# Altium schematic sheet MSP-ISO_Rev1_0.SchDoc
size 431 x 279 mm; Date: Not shown in title block; ApprovedBy: Not shown in title block; CheckedBy: Not shown in title block; Author: Not shown in title block; CompanyName: Not shown in title block; Engineer: Not shown in title block; Organization: Not shown in title block; Address1: Not shown in title block; Address2: Not shown in title block; Address3: Not shown in title block; Address4: Not shown in title block; DocumentNumber: 1; Revision: Use project parameter SCH_Rev; SheetNumber: 3; SheetTotal: 3; PageSetup: Record=PageOptions|CenterHorizontal=True|CenterVertical=True|PrintScale=0.66|XCorrection=1.00|YCorrection=1.00|PrintKind=0|BorderSize=5000000|LeftOffset=0|BottomOffset=0|Orientation=2|PaperLength=1000|PaperWidth=1000|Scale=100|PaperSource=15|PrintQuality=600|MediaType=1|DitherType=10|PrintScaleMode=1|PaperKind=Letter; CurrentTime: Not shown in title block; CurrentDate: Not shown in title block; Time: Not shown in title block; DocumentFullPathAndName: Not shown in title block; DocumentName: Not shown in title block; ModifiedDate: Not shown in title block; ImagePath: Not shown in title block
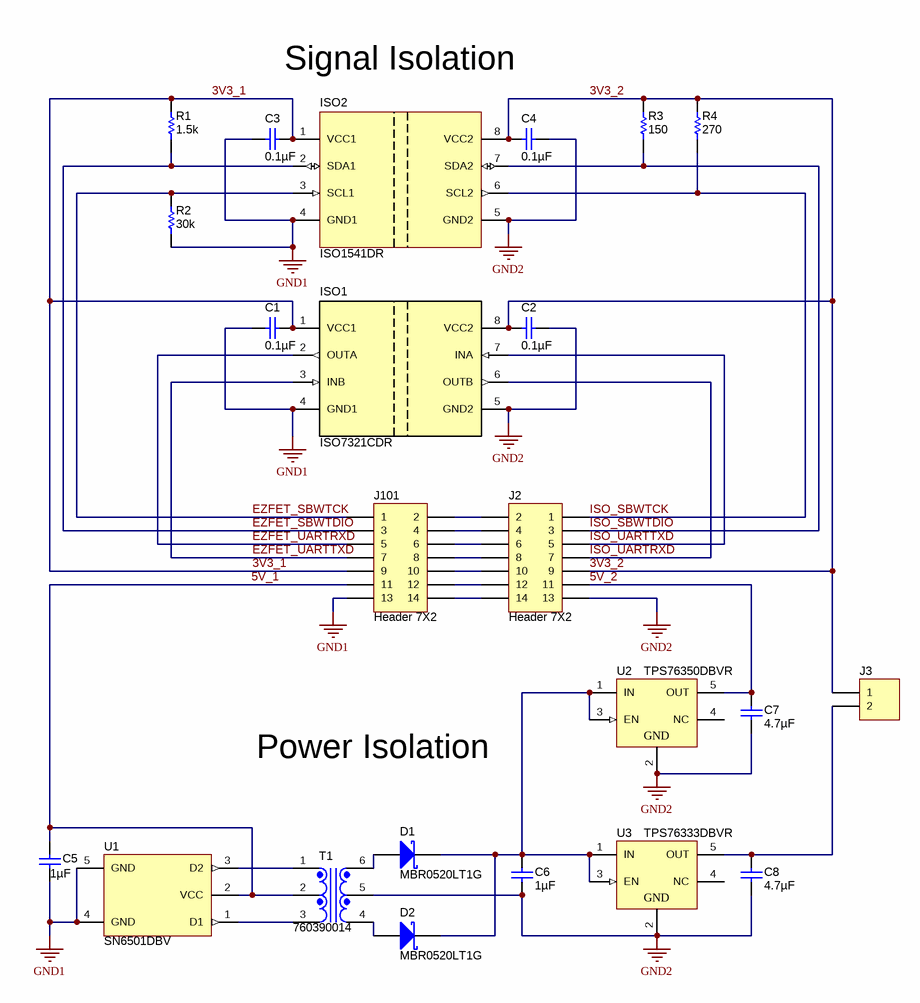
[diagram p0: MSP-ISO_Rev1_0.SchDoc]

## Parts
C1  ValueDisplayed: 0.1µF  [0603]  (hidden comment: 0603YC104JAT2A)
C2  ValueDisplayed: 0.1µF  [0603]  (hidden comment: 0603YC104JAT2A)
C3  ValueDisplayed: 0.1µF  [0603]  (hidden comment: 0603YC104JAT2A)
C4  ValueDisplayed: 0.1µF  [0603]  (hidden comment: 0603YC104JAT2A)
C5  ValueDisplayed: 1µF  [0603]  (hidden comment: C1608X7R1C105K)
C6  ValueDisplayed: 1µF  [0603]  (hidden comment: C1608X7R1C105K)
C7  ValueDisplayed: 4.7µF  [0603]  (hidden comment: C1608X5R0J475M)
C8  ValueDisplayed: 4.7µF  [0603]  (hidden comment: C1608X5R0J475M)
D1  MBR0520LT1G  [SOD-123]
D2  MBR0520LT1G  [SOD-123]
ISO1  ISO7321CDR  [D0008B_N]
ISO2  ISO1541DR  [D0008A_N]
J2  Header 7X2  [HDR2X7]
J3  Supply_components  [HDR1X2]  (value not drawn)
J101  Header 7X2  [HDR2X7]
R1  ValueDisplayed: 1.5k  [0402]  (hidden comment: CRCW04021K50JNED)
R2  ValueDisplayed: 30k  [0402]  (hidden comment: CRCW040230K0JNED)
R3  ValueDisplayed: 150  [0402]  (hidden comment: CRCW0402150RJNED)
R4  ValueDisplayed: 270  [0402]  (hidden comment: CRCW0402270RJNED)
T1  760390014  [Wurth_760390013]
U1  SN6501DBV  [DBV0005A_N]
U2  TPS76350DBVR  [DBV0005A_N]
U3  TPS76333DBVR  [DBV0005A_N]

## Nets
GND1: C1.2 C3.2 C5.2 ISO1.4(GND1) ISO2.4(GND1) J101.13 R2.1 U1.4(GND) U1.5(GND)
GND2: C2.2 C4.2 C6.2 C7.2 C8.2 ISO1.5(GND2) ISO2.5(GND2) J2.13 T1.5 U2.2(GND) U3.2(GND)
3V3_1: C1.1 C3.1 ISO1.1(VCC1) ISO2.1(VCC1) J101.9 R1.2
3V3_2: C2.1 C4.1 ISO1.8(VCC2) ISO2.8(VCC2) J2.9 J3.1 R3.2 R4.2
5V_1: C5.1 J101.11 T1.2 U1.2(VCC)
5V_2: C7.1 J2.11 U2.5(OUT)
EZFET_SBWTCK: ISO2.3(SCL1) J101.1 R2.2
EZFET_SBWTDIO: ISO2.2(SDA1) J101.3 R1.1
EZFET_UARTRXD: ISO1.2(OUTA) J101.5
EZFET_UARTTXD: ISO1.3(INB) J101.7
ISO_SBWTCK: ISO2.6(SCL2) J2.1 R4.1
ISO_SBWTDIO: ISO2.7(SDA2) J2.3 R3.1
ISO_UARTRXD: ISO1.6(OUTB) J2.7
ISO_UARTTXD: ISO1.7(INA) J2.5
NetC6_1: C6.1 D1.1(K) D2.1(K) U2.1(IN) U2.3(EN) U3.1(IN) U3.3(EN)
NetC8_1: C8.1 J3.2 U3.5(OUT)
NetD1_2: D1.2(A) T1.6
NetD2_2: D2.2(A) T1.4
NetJ2_2: J2.2 J101.2
NetJ2_4: J2.4 J101.4
NetJ2_6: J2.6 J101.6
NetJ2_8: J2.8 J101.8
NetJ2_10: J2.10 J101.10
NetJ2_12: J2.12 J101.12
NetJ2_14: J2.14 J101.14
NetT1_1: T1.1 U1.3(D2)
NetT1_3: T1.3 U1.1(D1)

Not connected (* = marked no-connect by the designer): U2 4(NC); U3 4(NC)

## Notes on the sheet
- Signal Isolation
- Power Isolation
- Drawn By:
- SVN Rev:
- Number:
- TID #:
- Orderable:
- Rev:
- Sheet Title:
- File:
- Project Title:
- Designed for:
- Assembly Variant:
- Mod. Date:
- Sheet:
- Size:
- of
- B
- http://www.ti.com
- Texas Instruments and/or its licensors do not warrant the accuracy or completeness of this specification or any information contained therein. Texas Instruments and/or its licensors do not warrant that this design will meet the specifications, will be suitable for your application or fit for any particular purpose, or will operate in an implementation. Texas Instruments and/or its licensors do not warrant that the design is production worthy. You should completely validate and test your design implementation to confirm the system functionality for your application.
- Engineer:
- Contact:
- © Texas Instruments

## Library data of the parts
C1-C4 = 0603YC104JAT2A: CAP, CERM, 0.1 µF, 16 V, +/- 5%, X7R, 0603; Manufacturer: AVX; Polarized: N; CompType: Capacitor; Value: 0.1uF; U/M: EA; Cap_F: 0.0000001; Tolerance_%: 5; ESR_ohm: 0.039; Value1: 0.039 ohm; VDC_V: 16; Value2: 16V; TaMin_C: -55; TaMax_C: 125; SymbolVersion: 2008-07-09; PartNumber: 0603YC104JAT2A; PackageReference: 0603; RoHS: Y; MountType: SMT; Technology: Ceramic; TempCo: X7R; Cap_Case: 0603; Published: 2008-06-19; Publisher: Texas Instruments; LatestRevisionDate: 2015-03-02; ComponentLink1Description: Datasheet link; ComponentLink1URL: http://www.avx.com/docs/masterpubs/smccp.pdf; Supplier 1: Digi-Key; Supplier Part Number 1: 478-3726-1-ND; Supplier 2: Mouser; Supplier Part Number 2: 581-0603YC104J; Supplier 3: Farnell; Supplier Part Number 3: 1740612
C5 C6 = C1608X7R1C105K: CAP, CERM, 1 µF, 16 V, +/- 10%, X7R, 0603; Manufacturer: TDK; Polarized: N; CompType: Capacitor; Value: 1uF; U/M: EA; Cap_F: 0.000001; Tolerance_%: 10; ESR_ohm: 0.0057; Value1: 0.0057 ohm; VDC_V: 16; Value2: 16V; TaMin_C: -55; TaMax_C: 125; SymbolVersion: 2008-07-09; PartNumber: C1608X7R1C105K; PackageReference: 0603; RoHS: Y; MountType: SMT; Technology: Ceramic; TempCo: X7R; Cap_Case: 0603; Published: 2008-06-19; Publisher: Texas Instruments; LatestRevisionDate: 2015-03-02; ComponentLink1Description: Datasheet link; ComponentLink1URL: http://www.tdk.co.jp/tefe02/e412_c.pdf; Supplier 1: Digi-Key; Supplier Part Number 1: 445-1604-1-ND; Supplier 2: Farnell; Supplier Part Number 2: 1907343
C7 C8 = C1608X5R0J475M: CAP, CERM, 4.7 µF, 6.3 V, +/- 20%, X5R, 0603; Manufacturer: TDK; Polarized: N; CompType: Capacitor; Value: 4.7uF; U/M: EA; Cap_F: 0.0000047; Tolerance_%: 20; ESR_ohm: 0.0036; Value1: 0.0036 ohm; VDC_V: 6.3; Value2: 6.3V; IRMS_A: 1.6; TaMin_C: -55; TaMax_C: 85; SymbolVersion: 2008-07-09; PartNumber: C1608X5R0J475M; PackageReference: 0603; RoHS: Y; MountType: SMT; Technology: Ceramic; TempCo: X5R; Cap_Case: 0603; Published: 2008-06-19; Publisher: Texas Instruments; LatestRevisionDate: 2015-03-02; ComponentLink1Description: Datasheet link; ComponentLink1URL: http://www.tdk.co.jp/tefe02/e412_c.pdf; Supplier 1: Digi-Key; Supplier Part Number 1: 445-1417-1-ND; Supplier 2: Farnell; Supplier Part Number 2: 1907342
D1 D2 = MBR0520LT1G: Diode, Schottky, 20 V, 0.5 A, SOD-123; Manufacturer: ON Semiconductor; U/M: EA; Vf_V: 0.385; Value: 20V; Value1: 0.5A; Value2: 0.385V; Io_A: 0.5; Vr_V: 20; TJmax_C: 125; RJC_CperW: 150; CompType: Diode; SymbolVersion: 2008-12-08; PartNumber: MBR0520LT1G; PackageReference: SOD-123; MountType: SMT; Type: Schottky; RoHS: Y; Published: 2008-06-26; Publisher: Texas Instruments; LatestRevisionDate: 2015-03-05; ComponentLink1Description: Datasheet link; ComponentLink1URL: http://www.onsemi.com/pub_link/Collateral/MBR0520LT1-D.PDF; Supplier 1: Digi-Key; Supplier Part Number 1: MBR0520LT1GOSCT-ND; Supplier 2: Mouser; Supplier Part Number 2: 863-MBR0520LT1G; Supplier 3: Farnell; Supplier Part Number 3: 9556915
ISO1 = ISO7321CDR: Robust EMC, Low Power, Dual-Channel Digital Isolators, D0008B; Manufacturer: Texas Instruments; SymbolCreator: a0411947; CompType: IC; U/M: EA; SymbolVersion: 2015-06-26; PartNumber: ISO7321CDR; Alternate PartNumber: ISO7321CD; PackageReference: D0008B; MountType: SMT; ComponentLink1Description: Datasheet Link; ComponentLink1URL: http://www.ti.com/lit/gpn/iso7321c; RoHS: Y; Publisher: Texas Instruments; LatestRevisionDate: 2015-08-14; Alternate Manufacturer: Texas Instruments
ISO2 = ISO1541DR: Low-Power Bidirectional I2C Isolators, D0008A; Manufacturer: Texas Instruments; SymbolCreator: a0411947; CompType: IC; U/M: EA; SymbolVersion: 2013-04-30; PartNumber: ISO1541DR; Alternate PartNumber: ISO1541D; PackageReference: D0008A; MountType: SMT; ComponentLink1Description: Datasheet Link; ComponentLink1URL: http://www.ti.com/lit/ds/symlink/iso1541.pdf; RoHS: Y; Publisher: Texas Instruments; LatestRevisionDate: 2015-08-14; Alternate Manufacturer: Texas Instruments
J2 J101 = Header 7X2: Header, 7-Pin, Dual row; LatestRevisionDate: 17-Jul-2002; LatestRevisionNote: Re-released for DXP Platform.; Publisher: Altium Limited
J3 = Header 2: Header, 2-Pin; LatestRevisionDate: 17-Jul-2002; LatestRevisionNote: Re-released for DXP Platform.; Publisher: Altium Limited
R1 = CRCW04021K50JNED: RES, 1.5 k, 5%, 0.063 W, 0402; Manufacturer: Vishay-Dale; CompType: Resistor; Value: 1.5k; Res_ohm: 1500; Value_Code: 1k50; Tolerance_%: 5; Power_W: 0.063; Value2: 0.063W; VDC_V: 50; TempCo: 200 ppm/C; EIA_Code: E24; U/M: EA; SymbolVersion: 2009-05-29; PartNumber: CRCW04021K50JNED; PackageReference: 0402; RoHS: Y; Value1: 5%; MountType: SMT; Technology: Thick Film; Published: 2008-06-26; Publisher: Texas Instruments; LatestRevisionDate: 2015-08-08; ComponentLink1Description: Datasheet link; ComponentLink1URL: http://www.vishay.com/docs/20035/dcrcwe3.pdf; Supplier 1: Digi-Key; Supplier Part Number 1: 541-1.5KJCT-ND; Supplier 2: Mouser; Supplier Part Number 2: 71-CRCW0402J-1.5K-E3; Supplier 3: Farnell; Supplier Part Number 3: 1558782
R2 = CRCW040230K0JNED: RES, 30 k, 5%, 0.063 W, 0402; Manufacturer: Vishay-Dale; CompType: Resistor; Value: 30k; Res_ohm: 30000; Value_Code: 30k0; Tolerance_%: 5; Power_W: 0.063; Value2: 0.063W; VDC_V: 50; TempCo: 200 ppm/C; EIA_Code: E24; U/M: EA; SymbolVersion: 2009-05-29; PartNumber: CRCW040230K0JNED; PackageReference: 0402; RoHS: Y; Value1: 5%; MountType: SMT; Technology: Thick Film; Published: 2008-06-26; Publisher: Texas Instruments; LatestRevisionDate: 2015-08-08; ComponentLink1Description: Datasheet link; ComponentLink1URL: http://www.vishay.com/docs/20035/dcrcwe3.pdf; Supplier 1: Digi-Key; Supplier Part Number 1: 541-30KJCT-ND; Supplier 2: Mouser; Supplier Part Number 2: 71-CRCW0402J-30K-E3; Supplier 3: Farnell; Supplier Part Number 3: 1514695
R3 = CRCW0402150RJNED: RES, 150, 5%, 0.063 W, 0402; Manufacturer: Vishay-Dale; CompType: Resistor; Value: 150; Value_Code: 150R; Tolerance_%: 5; Power_W: 0.063; Value2: 0.063W; VDC_V: 50; TempCo: 200 ppm/C; EIA_Code: E24; U/M: EA; SymbolVersion: 2009-05-29; PartNumber: CRCW0402150RJNED; PackageReference: 0402; RoHS: Y; Res_ohm: 150; Value1: 5%; MountType: SMT; Technology: Thick Film; Published: 2008-06-26; Publisher: Texas Instruments; LatestRevisionDate: 2015-08-08; ComponentLink1Description: Datasheet link; ComponentLink1URL: http://www.vishay.com/docs/20035/dcrcwe3.pdf; Supplier 1: Digi-Key; Supplier Part Number 1: 541-150JCT-ND; Supplier 2: Mouser; Supplier Part Number 2: 71-CRCW0402J-150-E3; Supplier 3: Farnell; Supplier Part Number 3: 1514673
R4 = CRCW0402270RJNED: RES, 270, 5%, 0.063 W, 0402; Manufacturer: Vishay-Dale; CompType: Resistor; Value: 270; Value_Code: 270R; Tolerance_%: 5; Power_W: 0.063; Value2: 0.063W; VDC_V: 50; TempCo: 200 ppm/C; EIA_Code: E24; U/M: EA; SymbolVersion: 2009-05-29; PartNumber: CRCW0402270RJNED; PackageReference: 0402; RoHS: Y; Res_ohm: 270; Value1: 5%; MountType: SMT; Technology: Thick Film; Published: 2008-06-26; Publisher: Texas Instruments; LatestRevisionDate: 2015-08-08; ComponentLink1Description: Datasheet link; ComponentLink1URL: http://www.vishay.com/docs/20035/dcrcwe3.pdf; Supplier 1: Digi-Key; Supplier Part Number 1: 541-270JCT-ND; Supplier 2: Mouser; Supplier Part Number 2: 71-CRCW0402J-270-E3; Supplier 3: Farnell; Supplier Part Number 3: 1514691
T1 = 760390014: Transformer, 475uH, SMT; Manufacturer: Wurth Elektronik eiSos; SymbolCreator: a0799628; DCR_Ohm: 0.31; U/M: EA; SymbolVersion: 2014-01-30; PartNumber: 760390014; Supplier 1: Digi-Key; Supplier Part Number 1: 732-4458-1-ND; Supplier 2: Mouser; Supplier Part Number 2: 710-760390014; CompType: Transformer; PackageReference: 10.05x4.19x6.73 mm; MountType: SMT; RoHS: Y; ComponentLink1Description: Datasheet Link; ComponentLink1URL: http://katalog.we-online.de/ctm/datasheet/760390014.pdf; Value: 475uH; Publisher: Texas Instruments; LatestRevisionDate: 2015-03-05
U1 = SN6501DBV: Transformer Driver for Isolated Power Supplies, DBV0005A; Manufacturer: Texas Instruments; SymbolCreator: a0411947; CompType: IC; U/M: EA; SymbolVersion: 2013-06-28; PartNumber: SN6501DBV; PackageReference: DBV0005A; MountType: SMT; ComponentLink1Description: Datasheet Link; ComponentLink1URL: http://www.ti.com/lit/ds/symlink/sn6501.pdf; RoHS: Y; Publisher: Texas Instruments; LatestRevisionDate: 2015-03-05; Alternate Manufacturer: Texas Instruments
U2 = TPS76350DBVR: Single Output LDO, 150 mA, Fixed 5 V Output, 2.7 to 10 V Input, with Low IQ, 5-pin SOT-23 (DBV), -40 to 125 degC, Green (RoHS & no Sb/Br); Manufacturer: Texas Instruments; Alternate Manufacturer: None; Alternate PartNumber: Equivalent; Accuracy(%): 3; Fixed Output Options(V): 5; Iout(Max)(A): 0.15; Iq(Typ)(mA): 0.08; SubFamily: Single Channel LDO; Vdo(Typ)(mV): 300; Vin(Max)(V): 10; Vin(Min)(V): 2.7; DatasheetVersion: SLVS181H; PackageVersion: 4073253-4/K; PackageReference: DBV0005A; PackageDescription: 5-Pin Plastic Small Outline, Body 1.60 Ã— 2.90 mm, Pitch 0.95 mm; Supplier 1: Digi-Key; Supplier Part Number 1: 296-11023-2-ND; Supplier 2: Digi-Key; Supplier Part Number 2: 296-11023-1-ND; Supplier 3: Digi-Key; Supplier Part Number 3: 296-11023-6-ND; Supplier 4: Farnell; Supplier Part Number 4: 1535761; Supplier 5: Newark; Supplier Part Number 5: 77C1037; Supplier 6: Mouser; Supplier Part Number 6: 595-TPS76350DBVR; Eco-Plan: Green (RoHS & no Sb/Br); Vout Adj(Max)(V): 5; Vout Adj(Min)(V): 5; MountType: SMT; Code_JEDEC: MO-178; PartNumber: TPS76350DBVR; ComponentLink1Description: Manufacturer URL; ComponentLink1URL: http://www.ti.com/; ComponentLink2Description: Datasheet; ComponentLink2URL: http://www.ti.com/general/docs/lit/getliterature.tsp?genericPartNumber=TPS76350&fileType=pdf; ComponentLink3Description: Package Specification; ComponentLink3URL: http://www.ti.com/litv/pdf/mpds018i
U3 = TPS76333DBVR: Single Output LDO, 150 mA, Fixed 3.3 V Output, 2.7 to 10 V Input, with Low IQ, 5-pin SOT-23 (DBV), -40 to 125 degC, Green (RoHS & no Sb/Br); Manufacturer: Texas Instruments; Alternate Manufacturer: None; Alternate PartNumber: Equivalent; Accuracy(%): 3; Fixed Output Options(V): 3.3; Iout(Max)(A): 0.15; Iq(Typ)(mA): 0.08; SubFamily: Single Channel LDO; Vdo(Typ)(mV): 300; Vin(Max)(V): 10; Vin(Min)(V): 2.7; DatasheetVersion: SLVS181H; PackageVersion: 4073253-4/K; PackageReference: DBV0005A; PackageDescription: 5-Pin Plastic Small Outline, Body 1.60 Ã— 2.90 mm, Pitch 0.95 mm; Supplier 1: Digi-Key; Supplier Part Number 1: 296-11021-2-ND; Supplier 2: Digi-Key; Supplier Part Number 2: 296-11021-1-ND; Supplier 3: Digi-Key; Supplier Part Number 3: 296-11021-6-ND; Supplier 4: Farnell; Supplier Part Number 4: 1422252; Supplier 5: Newark; Supplier Part Number 5: 77C1035; Supplier 6: Mouser; Supplier Part Number 6: 595-TPS76333DBVR; Eco-Plan: Green (RoHS & no Sb/Br); Vout Adj(Max)(V): 3.3; Vout Adj(Min)(V): 3.3; MountType: SMT; Code_JEDEC: MO-178; PartNumber: TPS76333DBVR; ComponentLink1Description: Manufacturer URL; ComponentLink1URL: http://www.ti.com/; ComponentLink2Description: Datasheet; ComponentLink2URL: http://www.ti.com/general/docs/lit/getliterature.tsp?genericPartNumber=TPS76333&fileType=pdf; ComponentLink3Description: Package Specification; ComponentLink3URL: http://www.ti.com/litv/pdf/mpds018i